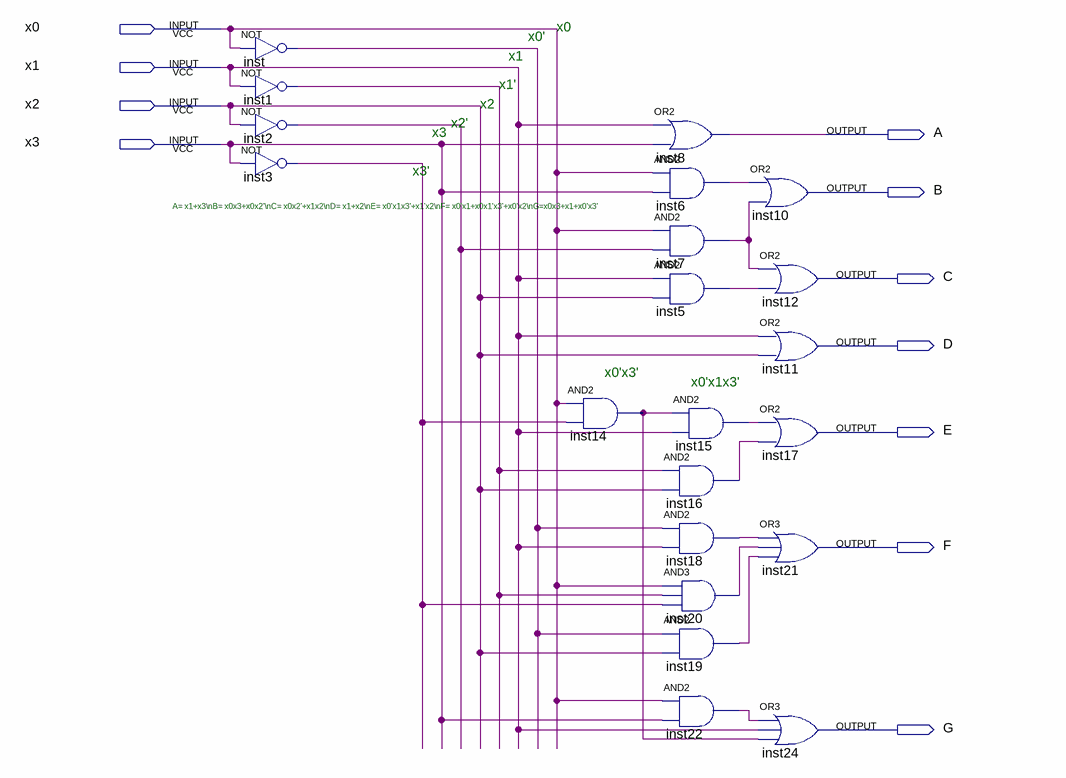
[diagram p0: schematic sheet]
// Quartus schematic lab2_g8_p2.bdf as structural Verilog: 21 symbols, 11 pins
module lab2_g8_p2 (
  input  x0,
  input  x1,
  input  x2,
  input  x3,
  output A,
  output B,
  output C,
  output D,
  output E,
  output F,
  output G
);

  wire inst1_out, inst2_out, inst3_out, inst5_out, inst6_out, inst7_out, inst14_out, inst15_out, inst16_out,
       inst18_out, inst19_out, inst20_out, inst22_out, inst_out;

  not inst (inst_out, x0);
  not inst1 (inst1_out, x1);
  not inst2 (inst2_out, x2);
  not inst3 (inst3_out, x3);
  and inst14 (inst14_out, x0, inst3_out);
  or inst8 (A, x1, x3);
  and inst6 (inst6_out, x0, x3);
  and inst7 (inst7_out, x0, inst2_out);
  and inst5 (inst5_out, x1, x2);
  and inst15 (inst15_out, inst14_out, x1);
  and inst16 (inst16_out, inst1_out, x2);
  and inst18 (inst18_out, inst_out, x1);
  and inst20 (inst20_out, x0, inst1_out, inst3_out);
  and inst19 (inst19_out, inst_out, x2);
  and inst22 (inst22_out, x0, x3);
  or inst10 (B, inst6_out, inst7_out);
  or inst12 (C, inst7_out, inst5_out);
  or inst11 (D, x1, x2);
  or inst17 (E, inst15_out, inst16_out);
  or inst21 (F, inst18_out, inst20_out, inst19_out);
  or inst24 (G, inst22_out, x1, inst14_out);

  // Notes on the sheet:
  //   x0
  //   x0'
  //   x1
  //   x1'
  //   x2
  //   x2'
  //   x3
  //   x3'
  //   A= x1+x3\nB= x0x3+x0x2'\nC= x0x2'+x1x2\nD= x1+x2\nE= x0'x1x3'+x1'x2\nF= x0'x1+x0x1'x3'+x0'x2\nG=x0x3+x1+x0'x3'
  //   x0'x3'
  //   x0'x1x3'
endmodule
